# EAGLE design NANO33BLE_V4.0 (EAGLE 9.6.2)
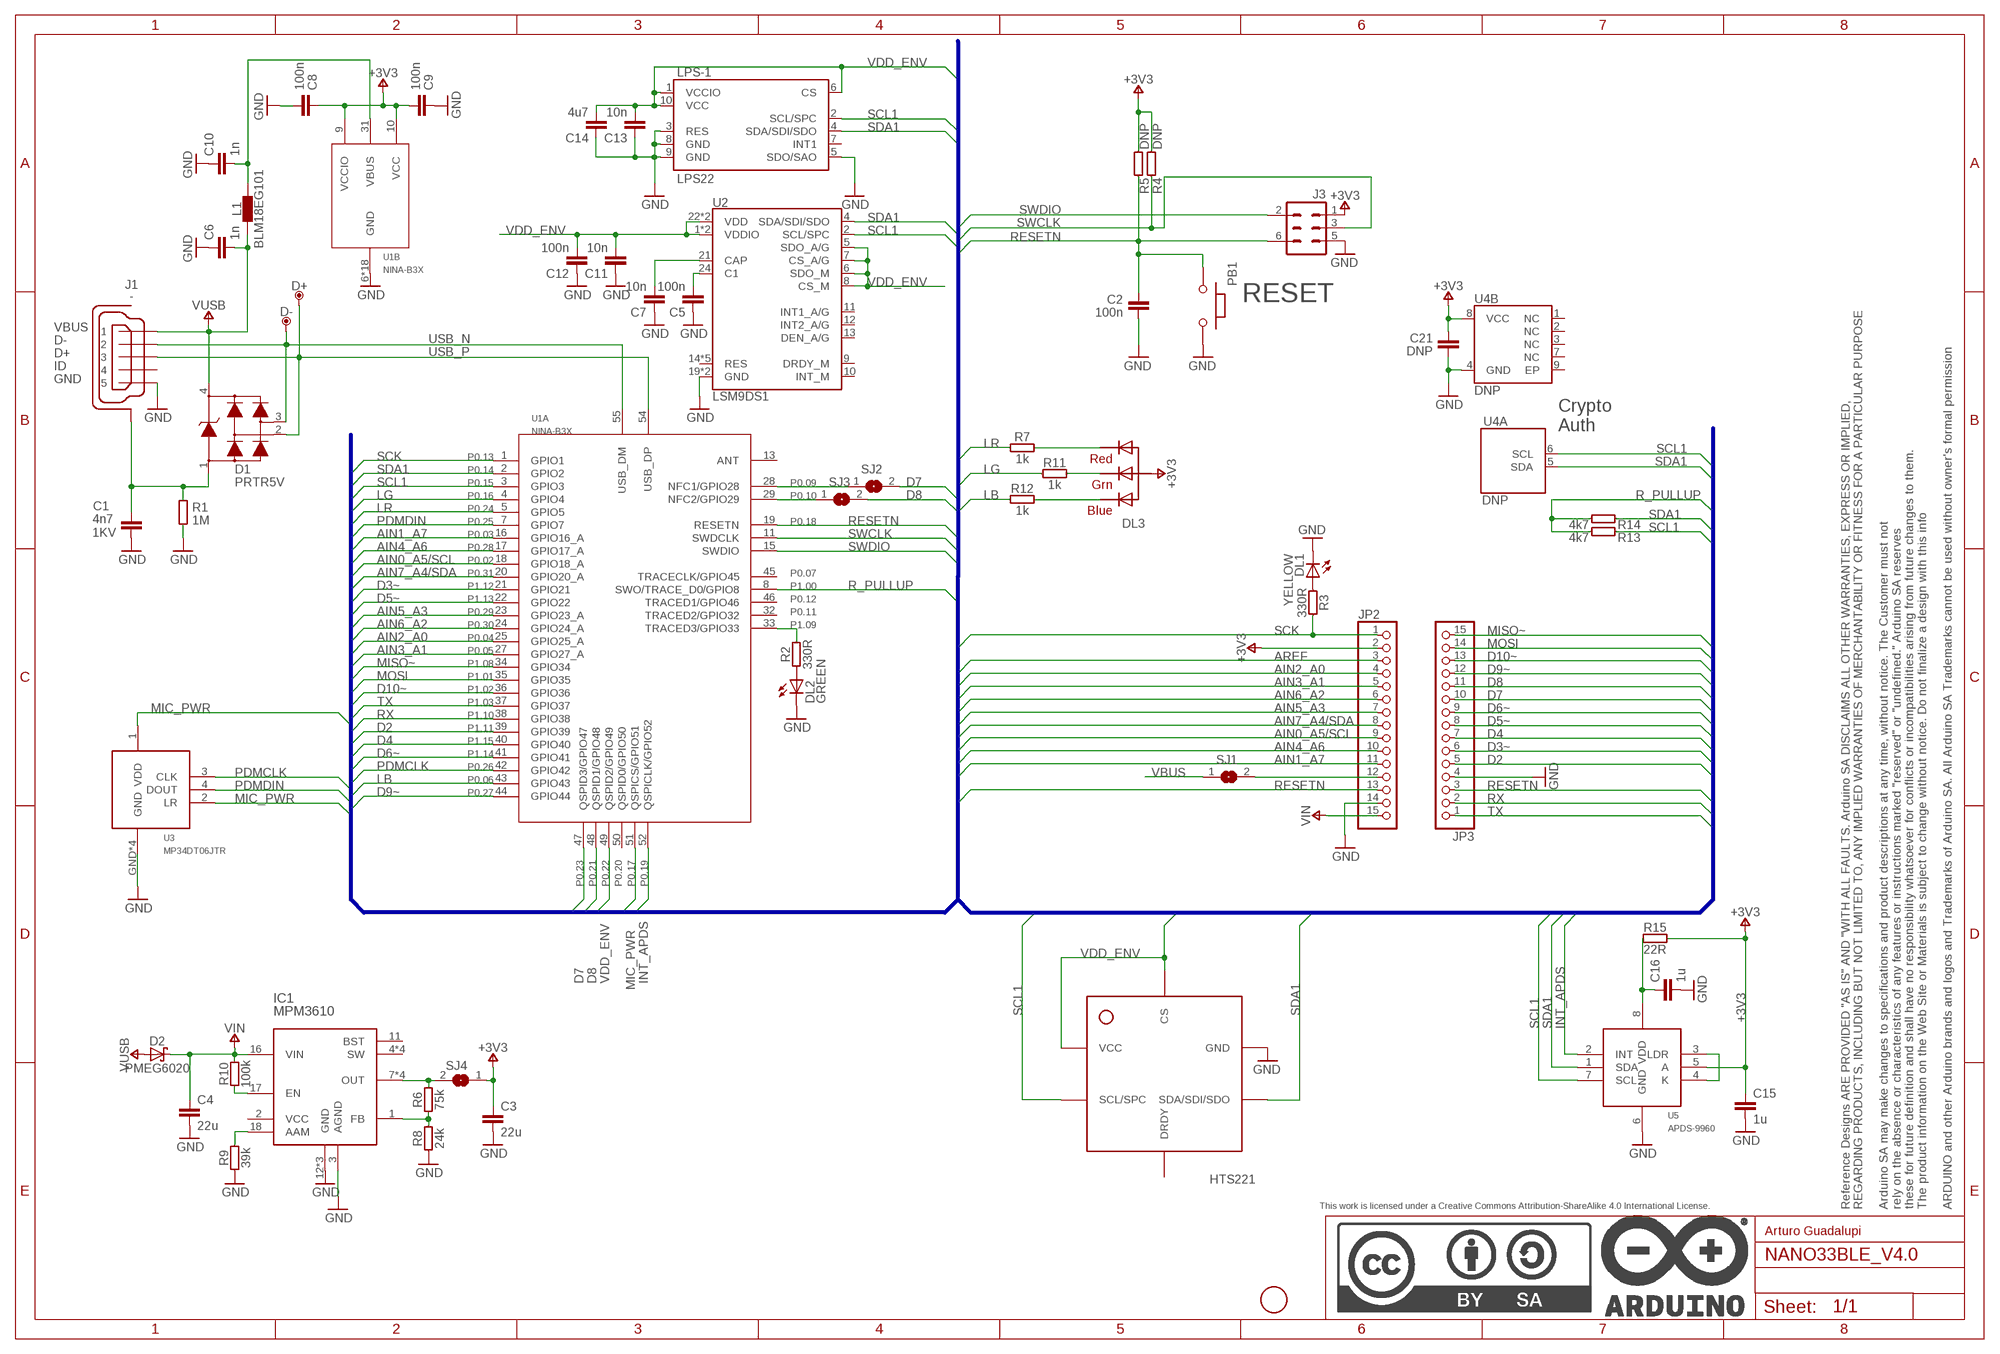
[diagram p0: schematic, sheet 1]

## Parts
C1  4n7  C4.7NF-0805  [0805-R2013X50N]
C2  100n  C-100NF-0402  [0402-1005X55N]
C3  22u  C-22U-0805  [0805-R2013X50N]
C4  22u  C-22U-0805  [0805-R2013X50N]
C5  100n  C-100NF-0402  [0402-1005X55N]
C6  1n  C-1NF-0402  [0402-1005X55N]
C7  10n  C-10NF-0402  [0402-1005X55N]
C8  100n  C-100NF-0402  [0402-1005X55N]
C9  100n  C-100NF-0402  [0402-1005X55N]
C10  1n  C-1NF-0402  [0402-1005X55N]
C11  10n  C-10NF-0402  [0402-1005X55N]
C12  100n  C-100NF-0402  [0402-1005X55N]
C13  10n  C-10NF-0402  [0402-1005X55N]
C14  4u7  C-4.7UF-0402  [0402-1005X55N]
C15  1u  C-1UF-0402  [0402-1005X55N]
C16  1u  C-1UF-0402  [0402-1005X55N]
C21  DNP  CDNP-0402  [0402-1005X55N]
D1  PRTR5V  PRTR5V0U2X,215  [SOT190P230X110-4N]
D2  PMEG6020  PMEG6020AELRX  [SODFL3517X110N]
D+  DNP  TPTP-1.00MM  [TP-1.00MM]
D-  DNP  TPTP-1.00MM  [TP-1.00MM]
DL1  YELLOW  LED-YELLOW-0603  [LEDC1608X80N-AK]
DL2  GREEN  LED-GREEN-0603  [LEDC1608X80N-AK]
DL3  -  RGBLED-KA  [SMLP34RGB2W]
FD1  DNP  FIDUCIAL-1.5MM  [FD-1-1.5]
FRAME1  DNP  A3-FRAME  [FRAME]
HS-1  HTS221  [HTS221]
IC1  MPM3610  [MPM3610]
J1  -  USB-MICRO  [ZX62-AB-5PA]
J3  DNP  PINHD-2X03(NO4)  [2X03-TP1]
JP2  PINHD-1X15-CASTELLATED  [1X15-CASTELL]
JP3  PINHD-1X15-CASTELLATED  [1X15-CASTELL]
L1  BLM18EG101  FERRITE-100R0603  [0603-1608X90N]
LPS-1  LPS22  LPS2XH-22  [LPS22H]
PB1  TACTILE3NO_SH  [C&K_PTS820_NO_SH]
R1  1M  R-1M-0402  [0402-1005X55N]
R2  330R  R-330R-0402  [0402-1005X55N]
R3  330R  R-330R-0402  [0402-1005X55N]
R4  DNP  R-DNP-0402  [0402-1005X55N]
R5  DNP  R-DNP-0402  [0402-1005X55N]
R6  75k  R-75K-0402  [0402-1005X55N]
R7  1k  R-1K-0402  [0402-1005X55N]
R8  24k  R-24K-0402  [0402-1005X55N]
R9  39k  R-39K-0402  [0402-1005X55N]
R10  100k  R-100K-0402  [0402-1005X55N]
R11  1k  R-1K-0402  [0402-1005X55N]
R12  1k  R-1K-0402  [0402-1005X55N]
R13  4k7  R-4K7-0402  [0402-1005X55N]
R14  4k7  R-4K7-0402  [0402-1005X55N]
R15  22R  R-22R-0402  [0402-1005X55N]
SJ1  DNP  SJ  [SJ]
SJ2  DNP  SJ  [SJ]
SJ3  DNP  SJ  [SJ]
SJ4  DNP  SJ  [SJ]
U1  NINA-B3X  [NINA-B3X]
U2  LSM9DS1  LSM9DS1_TEMP_LSM9DS1  [LSM9DS1_TEMP_LGA24-8X4]
U3  MP34DT06JTR  MP34DT06  [HCLGA]
U4  DNP  ATECC-DNP8-UDFN  [SON50P300X200X60-9N-EP160X140]
U5  APDS-9960  APDS9960  [APDS9960]

## Nets
+3V3: C3.1 C8.1 C9.2 C15.1 C21.1 DL3.1(A) J3.1 JP2.2 R4.2 R5.2 R15.2 SJ4.1 U1.9(B:VCCIO) U1.10(B:VCC) U4.8(B:VCC) U5.5(A)
AIN0_A5/SCL: JP2.9 U1.18(A:GPIO18_A)
AIN1_A7: JP2.11 U1.16(A:GPIO16_A)
AIN2_A0: JP2.4 U1.25(A:GPIO25_A)
AIN3_A1: JP2.5 U1.27(A:GPIO27_A)
AIN4_A6: JP2.10 U1.17(A:GPIO17_A)
AIN5_A3: JP2.7 U1.23(A:GPIO23_A)
AIN6_A2: JP2.6 U1.24(A:GPIO24_A)
AIN7_A4/SDA: JP2.8 U1.20(A:GPIO20_A)
AREF: JP2.3
D2: JP3.5 U1.39(A:GPIO39)
D3~: JP3.6 U1.21(A:GPIO21)
D4: JP3.7 U1.40(A:GPIO40)
D5~: JP3.8 U1.22(A:GPIO22)
D6~: JP3.9 U1.41(A:GPIO41)
D7: JP3.10 SJ2.2 U1.47(A:QSPID3/GPIO47)
D8: JP3.11 SJ3.2 U1.48(A:QSPID1/GPIO48)
D9~: JP3.12 U1.44(A:GPIO44)
D10~: JP3.13 U1.36(A:GPIO36)
GND: C1.2 C2.2 C3.2 C4.2 C5.1 C6.1 C7.1 C8.2 C9.1 C10.1 C11.1 C12.1 C13.1 C14.1 C15.2 C16.2 C21.2 DL1.C DL2.C HS-1.P$5.GND(GND) IC1.3(AGND) IC1.12(GND) IC1.13(GND) IC1.14(GND) J1.5 J3.5 JP2.14 JP3.4 LPS-1.3(RES) LPS-1.5(SDO/SAO) LPS-1.8(GND) LPS-1.9(GND) PB1.6 R1.1 R8.1 R9.1 U1.6(B:GND) U1.12(B:GND) U1.14(B:GND) U1.26(B:GND) U1.30(B:GND) U1.53(B:GND) U1.GND@1(B:GND) U1.GND@2(B:GND) U1.GND@3(B:GND) U1.GND@4(B:GND) U1.GND@5(B:GND) U1.GND@6(B:GND) U1.GND@7(B:GND) U1.GND@8(B:GND) U1.GND@9(B:GND) U1.GND@10(B:GND) U1.GND@11(B:GND) U1.GND@12(B:GND) U2.19(GND) U2.20(GND) U3.GND U3.GND@2(GND) U3.GND@3(GND) U3.GND@4(GND) U4.4(B:GND) U5.6(GND)
INT_APDS: U1.52(A:QSPICLK/GPIO52) U5.2(INT)
LB: R12.1 U1.43(A:GPIO43)
LG: R11.1 U1.4(A:GPIO4)
LR: R7.1 U1.5(A:GPIO5)
MIC_PWR: U1.51(A:QSPICS/GPIO51) U3.1(VDD) U3.2(LR)
MISO~: JP3.15 U1.34(A:GPIO34)
MOSI: JP3.14 U1.35(A:GPIO35)
N$1: C1.1 D1.1 J1.6(SH) J1.7(SH) J1.8(SH) J1.9(SH) J1.10(SH) J1.11(SH) R1.2
N$2: DL2.A R2.1
N$3: DL1.A R3.1
N$4: C5.2 U2.24(C1)
N$5: IC1.1(FB) R6.1 R8.2
N$6: IC1.18(AAM) R9.2
N$7: IC1.17(EN) R10.1
N$8: C7.2 U2.21(CAP)
N$9: U5.3(LDR) U5.4(K)
N$10: R2.2 U1.33(A:TRACED3/GPIO33)
N$11: DL3.3(BLUE_C) R12.2
N$12: DL3.2(RED_C) R7.2
N$13: DL3.4(GREEN_C) R11.2
N$14: JP2.12 SJ1.2
N$15: C16.1 R15.1 U5.8(VDD)
N$16: IC1.7(OUT) IC1.8(OUT) IC1.9(OUT) IC1.20(OUT) R6.2 SJ4.2
NFC1: SJ2.1 U1.28(A:NFC1/GPIO28)
NFC2: SJ3.1 U1.29(A:NFC2/GPIO29)
PDMCLK: U1.42(A:GPIO42) U3.3(CLK)
PDMDIN: U1.7(A:GPIO7) U3.4(DOUT)
R_PULLUP: R13.2 R14.2 U1.8(A:SWO/TRACE_D0/GPIO8)
RESETN: C2.1 J3.6 JP2.13 JP3.3 PB1.5 R5.1 U1.19(A:RESETN)
RX: JP3.2 U1.38(A:GPIO38)
SCK: JP2.1 R3.2 U1.1(A:GPIO1)
SCL1: HS-1.P$2.SCL/SPC(SCL/SPC) LPS-1.2(SCL/SPC) R13.1 U1.3(A:GPIO3) U2.2(SCL/SPC) U4.6(A:SCL) U5.7(SCL)
SDA1: HS-1.P$4.SDA/SDI/SDO(SDA/SDI/SDO) LPS-1.4(SDA/SDI/SDO) R14.1 U1.2(A:GPIO2) U2.4(SDA/SDI/SDO) U4.5(A:SDA) U5.1(SDA)
SWCLK: J3.3 R4.1 U1.11(A:SWDCLK)
SWDIO: J3.2 U1.15(A:SWDIO)
TX: JP3.1 U1.37(A:GPIO37)
USB_N [usb]: D1.3 D-.X J1.2 U1.55(A:USB_DM)
USB_P [usb]: D1.2 D+.X J1.3 U1.54(A:USB_DP)
VBUS: C10.2 L1.2 SJ1.1 U1.31(B:VBUS)
VDD_ENV: C11.2 C12.2 C13.2 C14.2 HS-1.P$1.VDD(VCC) HS-1.P$6.CS(CS) LPS-1.1(VCCIO) LPS-1.6(CS) LPS-1.10(VCC) U1.49(A:QSPID2/GPIO49) U2.1(VDDIO) U2.3(VDDIO) U2.5(SDO_A/G) U2.6(SDO_M) U2.7(CS_A/G) U2.8(CS_M) U2.22(VDD) U2.23(VDD)
VIN: C4.1 D2.C IC1.16(VIN) JP2.15 R10.2
VUSB: C6.2 D1.4 D2.A J1.1 L1.1
Unconnected: HS-1.P$3.DRDY(DRDY) IC1.2(VCC) IC1.4(SW) IC1.5(SW) IC1.6(SW) IC1.11(BST) IC1.19(SW) J1.4 LPS-1.7(INT1) U1.13(A:ANT) U1.32(A:TRACED2/GPIO32) U1.45(A:TRACECLK/GPIO45) U1.46(A:TRACED1/GPIO46) U1.50(A:QSPID0/GPIO50) U2.9(DRDY_M) U2.10(INT_M) U2.11(INT1_A/G) U2.12(INT2_A/G) U2.13(DEN_A/G) U2.14(RES) U2.15(RES) U2.16(RES) U2.17(RES) U2.18(RES) U4.1(B:NC) U4.2(B:NC) U4.3(B:NC) U4.7(B:NC) U4.9(B:EP)

## Buses
+3V3,+3V3D,A1,A6,A7,AIN0_A5/SCL,AIN1_A7,AIN2_A0,AIN3_A1,AIN4_A6,AIN5_A3,AIN6_A2,AIN7_A4/SDA,APDS_PWR,AREF,D2,D3~,D4,D5~,D6~,D7,D8,D9~,D10~,GND,INT_APDS,LB,LED_BLUE,LED_GREEN,LED_RED,LG,LR,MIC_PWR,MISO~,MOSI,NFC1,NFC2,PA12_S2_TX/MOSI,PA13_S2_RX/MISO,PA14_S2_RTS/CS,PA15_S2_CTS/SCK,PA22_TC4-W0,PA23_TC4-W1,PA27_GPIO0,PA28_ACK,PB08_RST,PB11_TCC0-W5,PDMCLK,PDMDIN,RESET#,RESETN,R_PULLUP,RSTN_NINA,RX,RX_NINA,SCK,SCL1,SDA1,SWCLK,SWDIO,TX,TX_NINA,USB_N,USB_P,VBUS,VDD_ENV,VIN,VUSB
+3V3,+3V3D,A1,A6,A7,AIN1_A7,AIN2_A0,AIN3_A1,AIN4_A6,AIN5_A3,AIN6_A2,APDS_PWR,AREF,D2,D3~,D4,D5~,D6~,D7,D8,D9~,D10~,GND,LB,LED_BLUE,LED_GREEN,LED_RED,LG,LR,MISO~,MOSI,N$1,N$2,N$3,N$4,N$5,N$6,N$7,N$8,N$10,N$11,N$12,N$13,NFC1,NFC2,PA12_S2_TX/MOSI,PA13_S2_RX/MISO,PA14_S2_RTS/CS,PA15_S2_CTS/SCK,PA27_GPIO0,PA28_ACK,PB08_RST,RESETN,R_PULLUP,RSTN_NINA,RX,RX_NINA,SCK,SCL1,SDA1,SWCLK,SWDIO,TX,TX_NINA,USB_N,USB_P,VBUS,VDD_ENV,VIN,VUSB

## Notes on the sheet
- RESET
- Crypto
  Auth
- HTS221
- Arturo Guadalupi

## Library data of the parts
C1 = Arduino-rcl:C: SMD Capacitor; CODE-ARDUINO: 0689; DATASHEET: http://www.kemet.com/Lists/ProductCatalog/Attachments/40/KEM_C1010_X7R_HV_SMD.pdf; DISTRIBUTOR-LINK: www.kemet.com/docfinder?Partnumber=C0805C472KDRACTU; DISTRIBUTOR-PN: 399-6738-1-ND; MANUFACTURER: Kemet; MANUFACTURER-PN: C0805C472KDRACTU; NOTE: -; VOLTAGE: 1KV
C2 C5 C8 C9 C12 = Arduino-rcl:C: SMD Capacitor; CODE-ARDUINO: 0132; DATASHEET: http://www.tdk.com/pdf/TDKMLCCCapRange.pdf; DISTRIBUTOR-LINK: http://www.digikey.com/product-detail/en/tdk-corporation/C1005X5R1H104K050BB/445-5942-1-ND/2443982; DISTRIBUTOR-PN: 445-5942-1-ND; MANUFACTURER: TDK; MANUFACTURER-PN: C1005X5R1H104K050BB; NOTE: -
C3 C4 = Arduino-rcl:C: SMD Capacitor; CODE-ARDUINO: 2233; DATASHEET: https://media.digikey.com/pdf/Data%20Sheets/Samsung%20PDFs/CL21A226MQCLQNC_character.pdf; DISTRIBUTOR-LINK: https://www.digikey.com/product-detail/en/samsung-electro-mechanics-america-inc/CL21A226MQCLQNC/1276-2412-1-ND/3890498; DISTRIBUTOR-PN: 1276-2412-1-ND; MANUFACTURER: Samsung; MANUFACTURER-PN: CL21A226MQCLQNC; NOTE: -
C6 C10 = Arduino-rcl:C: SMD Capacitor; CODE-ARDUINO: 2321; DATASHEET: http://www.samsungsem.com/kr/support/product-search/mlcc/__icsFiles/afieldfile/2016/08/18/S_CL05B102KB5NNNC.pdf; DISTRIBUTOR-LINK: http://www.digikey.com/product-detail/en/samsung-electro-mechanics-america-inc/CL05B102KB5NNNC/1276-1032-1-ND/3889118; DISTRIBUTOR-PN: 1276-1032-1-ND; MANUFACTURER: Samsung; MANUFACTURER-PN: CL05B102KB5NNNC; NOTE: -
C7 C11 C13 = Arduino-rcl:C: SMD Capacitor; CODE-ARDUINO: 0165; DATASHEET: http://search.murata.co.jp/Ceramy/image/img/A01X/partnumbering_e_01.pdf; DISTRIBUTOR-LINK: http://www.digikey.com/product-detail/en/murata-electronics-north-america/GRM155R71H103KA88J/490-6351-1-ND/3845548; DISTRIBUTOR-PN: 490-6351-1-ND; MANUFACTURER: Murata; MANUFACTURER-PN: GRM155R71H103KA88J; NOTE: -
C14 = Arduino-rcl:C: SMD Capacitor; CODE-ARDUINO: 0833; DATASHEET: http://search.murata.co.jp/Ceramy/image/img/A01X/partnumbering_e_01.pdf; DISTRIBUTOR-LINK: http://www.digikey.com/product-detail/en/murata-electronics-north-america/GRM155R60J475ME47D/490-5915-1-ND/3719860; DISTRIBUTOR-PN: 490-5915-1-ND; MANUFACTURER: Murata; MANUFACTURER-PN: GRM155R60J475ME47D; NOTE: -
C15 C16 = Arduino-rcl:C: SMD Capacitor; CODE-ARDUINO: 0133; DATASHEET: http://search.murata.co.jp/Ceramy/image/img/A01X/partnumbering_e_01.pdf; DISTRIBUTOR-LINK: http://www.digikey.com/product-detail/en/murata-electronics-north-america/GRM155R61E105KA12D/490-10017-1-ND/5026367; DISTRIBUTOR-PN: 490-10017-1-ND; MANUFACTURER: Murata; MANUFACTURER-PN: GRM155R61E105KA12D; NOTE: -
C21 = Arduino-rcl:C: SMD Capacitor; CODE-ARDUINO: DNP; DATASHEET: DNP; DISTRIBUTOR-LINK: DNP; DISTRIBUTOR-PN: DNP; MANUFACTURER: DNP; MANUFACTURER-PN: DNP; NOTE: DNP
D1 = Arduino-diodes:PRTR5V0U2X,215: USB ESD protection; CODE-ARDUINO: 2209; DATASHEET: http://www.nxp.com/documents/data_sheet/PRTR5V0U2X.pdf; DISTRIBUTOR-LINK: http://www.digikey.com/product-detail/en/nxp-semiconductors/PRTR5V0U2X,215/568-4140-1-ND/1589981; DISTRIBUTOR-PN: 568-4140-1-ND; MANUFACTURER: NXP; MANUFACTURER-PN: PRTR5V0U2X,215
D2 = Arduino-diodes:PMEG6020AELRX: 60 V, 2 A low leakage current Schottky barrier rectifier Datasheet <http://www.nxp.com/documents/data_sheet/PMEG6020AELR.pdf>; CODE-ARDUINO: 2208; DATASHEET: http://www.nxp.com/documents/data_sheet/PMEG6020AELR.pdf; DISTRIBUTOR-LINK: http://www.digikey.com/products/en?keywords=%20568-12710-1-ND; DISTRIBUTOR-PN: 568-12710-1-ND; MANUFACTURER: NXP; MANUFACTURER-PN: PMEG6020AELRX
D+ D- = Arduino-utility:TP: Testpoint; CODE-ARDUINO: DNP; DATASHEET: DNP; DISTRIBUTOR-LINK: DNP; DISTRIBUTOR-PN: DNP; MANUFACTURER: DNP; MANUFACTURER-PN: DNP
DL1 = Arduino-diodes:LED: LED; CODE-ARDUINO: 2243; DATASHEET: http://media.digikey.com/pdf/Data%20Sheets/Avago%20PDFs/HSMz-Czzz.pdf; DISTRIBUTOR-LINK: http://www.digikey.com/product-detail/en/broadcom-limited/HSMY-C190/516-1424-1-ND/637748; DISTRIBUTOR-PN: 516-1424-1-ND; MANUFACTURER: Avago; MANUFACTURER-PN: HSMY-C190
DL2 = Arduino-diodes:LED: LED; CODE-ARDUINO: 2204; DATASHEET: http://media.digikey.com/pdf/Data%20Sheets/Avago%20PDFs/HSMz-Czzz.pdf; DISTRIBUTOR-LINK: http://www.digikey.com/product-detail/en/broadcom-limited/HSMG-C190/516-1425-1-ND/637749; DISTRIBUTOR-PN: 516-1425-1-ND; MANUFACTURER: Avago; MANUFACTURER-PN: HSMG-C190
DL3 = Arduino-diodes:RGBLED-KA: 5050 RGB LED; DATASHEET: https://www.rohm.com/datasheet/SMLP34RGB2W; DISTRIBUTOR-LINK: https://www.digikey.com/product-detail/en/rohm-semiconductor/SMLP34RGB2W3/SMLP34RGB2W3CT-ND/2921110; DISTRIBUTOR-PN: SMLP34RGB2W3CT-ND; MANUFACTURER-PN: SMLP34RGB2W3
FD1 = Arduino-utility:FIDUCIAL: Fiducial mount; CODE-ARDUINO: DNP; DATASHEET: DNP; DISTRIBUTOR-LINK: DNP; DISTRIBUTOR-PN: DNP; MANUFACTURER: DNP; MANUFACTURER-PN: DNP
FRAME1 = Arduino-utility:A3-FRAME; CODE-ARDUINO: DNP; DATASHEET: DNP; DISTRIBUTOR-LINK: DNP; DISTRIBUTOR-PN: DNP; MANUFACTURER: DNP; MANUFACTURER-PN: DNP; NOTE: DNP
HS-1 = Arduino-Sensors:HTS221; CODE-ARDUINO: A5356; DATASHEET: https://nl.mouser.com/datasheet/2/389/hts221-954783.pdf; DISTRIBUTOR-LINK: https://nl.mouser.com/ProductDetail/STMicroelectronics/HTS221TR?qs=%2fha2pyFaduhYqhgVSCoMJjbIcKdCD1D5p03chi4OA3k%3d; DISTRIBUTOR-PN: 511-HTS221TR; MANUFACTURER: STMicroelectronics; MANUFACTURER-PN: HTS221TR
IC1 = Arduino-ICs:MPM3610: MPM3610 Step Down Regulator; CODE-ARDUINO: 2093; DATASHEET: https://www.monolithicpower.com/pub/media/document/MPM3610_r1.01.pdf; DISTRIBUTOR-LINK: https://www.digikey.com/product-detail/en/monolithic-power-systems-inc/MPM3610AGQV-P/1589-1249-1-ND/5298336; DISTRIBUTOR-PN: 1589-1249-1-ND; MANUFACTURER: MPS; MANUFACTURER-PN: MPM3610AGQV-P; RESTRICTIONS: NO
J1 = Arduino-connectors:USB-MICRO: USB - micro AB USB 2.0 Receptacle Connector 5 Position Surface Mount, Right Angle, Horizontal; CODE-ARDUINO: 2219; DATASHEET: https://www.hirose.com/product/en/download_file/key_name/ZX/category/Catalog/doc_file_id/31704/?file_category_id=4&item_id=13&is_series=1; DISTRIBUTOR-LINK: http://www.digikey.com/product-detail/en/hirose-electric-co-ltd/ZX62-AB-5PA(31)/H125279CT-ND/5994741; DISTRIBUTOR-PN: H125279CT-ND; MANUFACTURER: Hirose; MANUFACTURER-PN: ZX62-AB-5PA(31)
J3 = Arduino-connectors:PINHD-2X03(NO4): PIN HEADER; CODE-ARDUINO: DNP; DATASHEET: DNP; DISTRIBUTOR-LINK: DNP; DISTRIBUTOR-PN: DNP; MANUFACTURER: DNP; MANUFACTURER-PN: DNP
JP2 JP3 = Arduino-connectors:PINHD-1X15: PIN HEADER
L1 = Arduino-rcl:FERRITE: SMD ferrite; CODE-ARDUINO: -; DATASHEET: http://www.murata.com/en-us/products/productdata/8796747366430/ENFA0021.pdf; DISTRIBUTOR-LINK: https://www.digikey.com/product-detail/en/murata-electronics-north-america/BLM18EG101TN1D/490-5978-1-ND/3845178; DISTRIBUTOR-PN: 490-5978-1-ND; MANUFACTURER: Murata; MANUFACTURER-PN: BLM18EG101TN1D; NOTE: -
LPS-1 = Arduino-Sensors:LPS2XH; CODE-ARDUINO: A5390; DATASHEET: https://www.st.com/content/ccc/resource/technical/document/datasheet/bf/c1/4f/23/61/17/44/8a/DM00140895.pdf/files/DM00140895.pdf/jcr:content/translations/en.DM00140895.pdf; DISTRIBUTOR-LINK: https://www.digikey.com/product-detail/en/stmicroelectronics/LPS22HBTR/497-16265-1-ND/5799917; DISTRIBUTOR-PN: 497-16265-1-ND; MANUFACTURER: ST; MANUFACTURER-PN: LPS22HBTR
PB1 = Arduino-pushbuttons:TACTILE3
R1 = Arduino-rcl:R: SMD Resistor; CODE-ARDUINO: 0139; DATASHEET: www.yageo.com.tw/exep/pages/download/literatures/PYu-R_INT-thick_7.pdf; DISTRIBUTOR-LINK: http://www.digikey.com/product-detail/en/yageo/RC0402JR-07330RL/311-330JRCT-ND/729412; DISTRIBUTOR-PN: 311-330JRCT-ND; MANUFACTURER: Yageo; MANUFACTURER-PN: RC0402JR-07330RL; NOTE: NO
R2 R3 = Arduino-rcl:R: SMD Resistor; CODE-ARDUINO: 2229; DATASHEET: www.yageo.com.tw/exep/pages/download/literatures/PYu-R_INT-thick_7.pdf; DISTRIBUTOR-LINK: http://www.digikey.com/product-detail/en/yageo/RC0402FR-07330RL/311-330LRCT-ND/729541; DISTRIBUTOR-PN: 311-330LRCT-ND; MANUFACTURER: Yageo; MANUFACTURER-PN: RC0402FR-07330RL; NOTE: NO
R4 R5 = Arduino-rcl:R: SMD Resistor; CODE-ARDUINO: DNP; DATASHEET: DNP; DISTRIBUTOR-LINK: DNP; DISTRIBUTOR-PN: DNP; MANUFACTURER: DNP; MANUFACTURER-PN: DNP; NOTE: NO
R6 = Arduino-rcl:R: SMD Resistor; CODE-ARDUINO: A5480; DATASHEET: www.yageo.com.tw/exep/pages/download/literatures/PYu-R_INT-thick_7.pdf; DISTRIBUTOR-LINK: https://www.digikey.com/products/en?keywords=%20AC0402JR-0775KL; DISTRIBUTOR-PN: AC0402JR-0775KL-ND; MANUFACTURER: Yageo; MANUFACTURER-PN: AC0402JR-0775KL; NOTE: NO
R7 R11 R12 = Arduino-rcl:R: SMD Resistor; CODE-ARDUINO: 0140; DATASHEET: www.yageo.com.tw/exep/pages/download/literatures/PYu-R_INT-thick_7.pdf; DISTRIBUTOR-LINK: http://www.digikey.com/product-detail/en/yageo/RC0402FR-071KL/311-1.00KLRCT-ND/729460; DISTRIBUTOR-PN: 311-1.00KLRCT-ND; MANUFACTURER: Yageo; MANUFACTURER-PN: RC0402FR-071KL; NOTE: NO
R8 = Arduino-rcl:R: SMD Resistor; CODE-ARDUINO: A5478; DATASHEET: http://www.yageo.com/NewPortal/yageodocoutput?fileName=/pdf/R-Chip/PYu-AC_51_RoHS_L_6.pdf; DISTRIBUTOR-LINK: https://www.digikey.com/products/en?keywords=AC0402JR-0724KL; DISTRIBUTOR-PN: AC0402JR-0724KL-ND; MANUFACTURER: Yageo; MANUFACTURER-PN: AC0402JR-0724KL; NOTE: NO
R9 = Arduino-rcl:R: SMD Resistor; CODE-ARDUINO: A5479; DATASHEET: www.yageo.com.tw/exep/pages/download/literatures/PYu-R_INT-thick_7.pdf; DISTRIBUTOR-LINK: https://www.digikey.com/product-detail/en/yageo/RC0402JR-0739KL/311-39KJRCT-ND/729420; DISTRIBUTOR-PN: 311-39KJRCT-ND; MANUFACTURER: Yageo; MANUFACTURER-PN: RC0402JR-0739KL; NOTE: NO
R10 = Arduino-rcl:R: SMD Resistor; CODE-ARDUINO: 0134; DATASHEET: www.yageo.com.tw/exep/pages/download/literatures/PYu-R_INT-thick_7.pdf; DISTRIBUTOR-LINK: http://www.digikey.com/product-detail/en/yageo/RC0402FR-07100KL/311-100KLRCT-ND/729473; DISTRIBUTOR-PN: 311-100KLRCT-ND; MANUFACTURER: Yageo; MANUFACTURER-PN: RC0402FR-07100KL; NOTE: NO
R13 R14 = Arduino-rcl:R: SMD Resistor; CODE-ARDUINO: 2196; DATASHEET: www.yageo.com.tw/exep/pages/download/literatures/PYu-R_INT-thick_7.pdf; DISTRIBUTOR-LINK: http://www.digikey.com/product-detail/en/yageo/RC0402FR-074K7L/311-4.7KLRCT-ND/2827881; DISTRIBUTOR-PN: 311-4.7KLRCT-ND; MANUFACTURER: Yageo; MANUFACTURER-PN: RC0402FR-074K7L; NOTE: NO
R15 = Arduino-rcl:R: SMD Resistor; CODE-ARDUINO: 0468; DATASHEET: www.yageo.com.tw/exep/pages/download/literatures/PYu-R_INT-thick_7.pdf; DISTRIBUTOR-LINK: http://www.digikey.com/products/en?keywords=311-22.0LRCT-ND; DISTRIBUTOR-PN: 311-22.0LRCT-ND; MANUFACTURER: Yageo; MANUFACTURER-PN: RC0402FR-0722RL; NOTE: NO
SJ1-SJ4 = Arduino-utility:SJ: SMD solder JUMPER; CODE-ARDUINO: DNP; DATASHEET: DNP; DISTRIBUTOR-LINK: DNP; DISTRIBUTOR-PN: DNP; MANUFACTURER: DNP; MANUFACTURER-PN: DNP
U1 = Arduino-ucs&SoCs:NINA-B3X: UBLOX BLE module
U2 = Arduino-ICs:LSM9DS1_TEMP_LSM9DS1: LSM9DS1 3D accelerometer, gyroscope & magnetometer The LSM9DS1 is a system-in-package featuring a 3D digital linear acceleration sensor, a 3D digital angular rate sensor, and a 3D digital magnetic sensor. The LSM9DS1 has a linear acceleration full scale of ±2g/±4g/±8/±16 g, a magnetic field full scale of ±4/±8/±12/±16 gauss and an angular rate of ±245/±500/±2000 dps. The LSM9DS1 includes an I2 C serial bus interface supporting standard and fast mode (100 kHz and 400 kHz) and an SPI serial standard interface. Magnetic, accelerometer and gyroscope sensing can be enabled or set in power-down mode separately for smart power management. The LSM9DS1 is available in a plastic land grid array package (LGA) and it is guaranteed to operate over an extended temperature range from -40 °C to +85 °C.; CODE-ARDUINO: A5430; DATASHEET: https://www.st.com/content/ccc/resource/technical/document/datasheet/1e/3f/2a/d6/25/eb/48/46/DM00103319.pdf/files/DM00103319.pdf/jcr:content/translations/en.DM00103319.pdf; DISTRIBUTOR-LINK: https://www.digikey.com/product-detail/en/stmicroelectronics/LSM9DS1TR/497-14946-1-ND/4988079; DISTRIBUTOR-PN: 497-14946-1-ND; MANUFACTURER: ST; MANUFACTURER-PN: LSM9DS1TR; NOTE: NO
U3 = Arduino-Sensors:MP34DT06; CODE-ARDUINO: A5470; DATSHEET: https://www.st.com/resource/en/datasheet/mp34dt06j.pdf; DISTRIBUTOR-LINK: https://www.digikey.com/product-detail/en/stmicroelectronics/MP34DT06JTR/497-18180-1-ND/9605997; DISTRIBUTOR-PN: 497-18180-1-ND; MANUFACTURER-PN: MP34DT06JTR
U4 = Arduino-ICs:ATECC: Secure authentication and product validation device, EEPROM, I2C, 2.0 - 5.5V; CODE-ARDUINO: DNP; DATASHEET: DNP; DISTRIBUTOR-LINK: DNP; DISTRIBUTOR-PN: DNP; MANUFACTURER: DNP; MANUFACTURER-PN: DNP; NOTE: DNP
U5 = Arduino-Sensors:APDS9960; CODE-ARDUINO: A5475; DATASHEET: https://docs.broadcom.com/docs/AV02-4191EN; DISTRIBUTOR-LINK: https://www.digikey.com/product-detail/en/broadcom-limited/APDS-9960/516-3480-1-ND/6677150; DISTRIBUTOR-PN: 516-3480-1-ND; MANUFACTURER: Broadcom; MANUFACTURER-PN: APDS-9960; NOTE: NO

## Net classes
0 default: width 0.19 mm, drill 0.19 mm
1 usb: width 0.19 mm, drill 0.19 mm

## Board
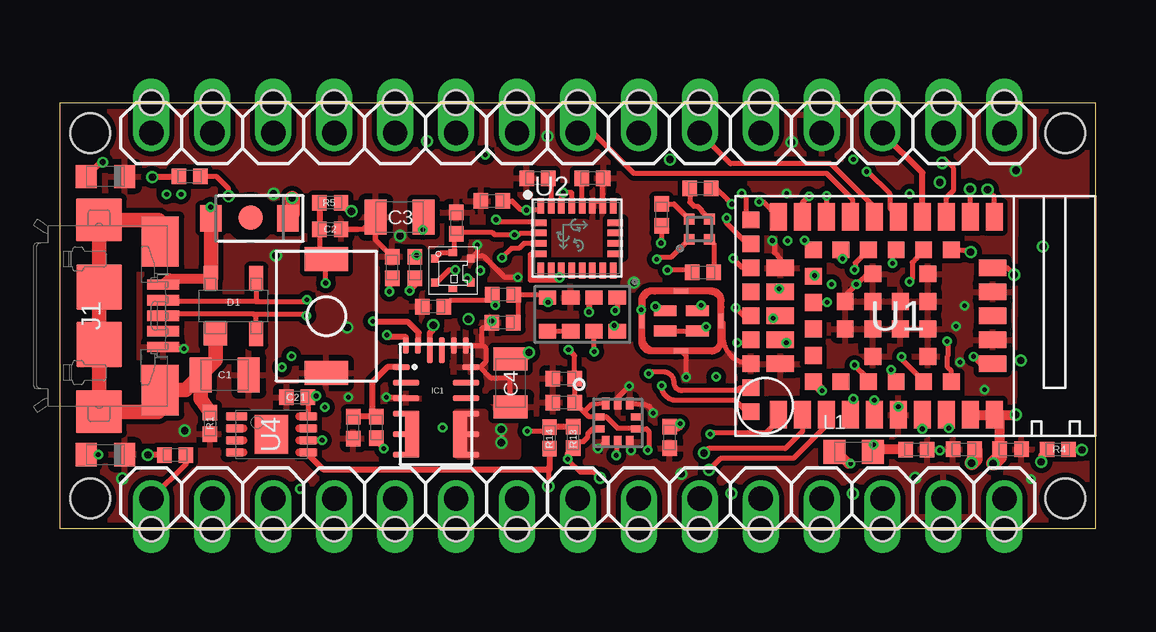
[diagram p1: board, top side]
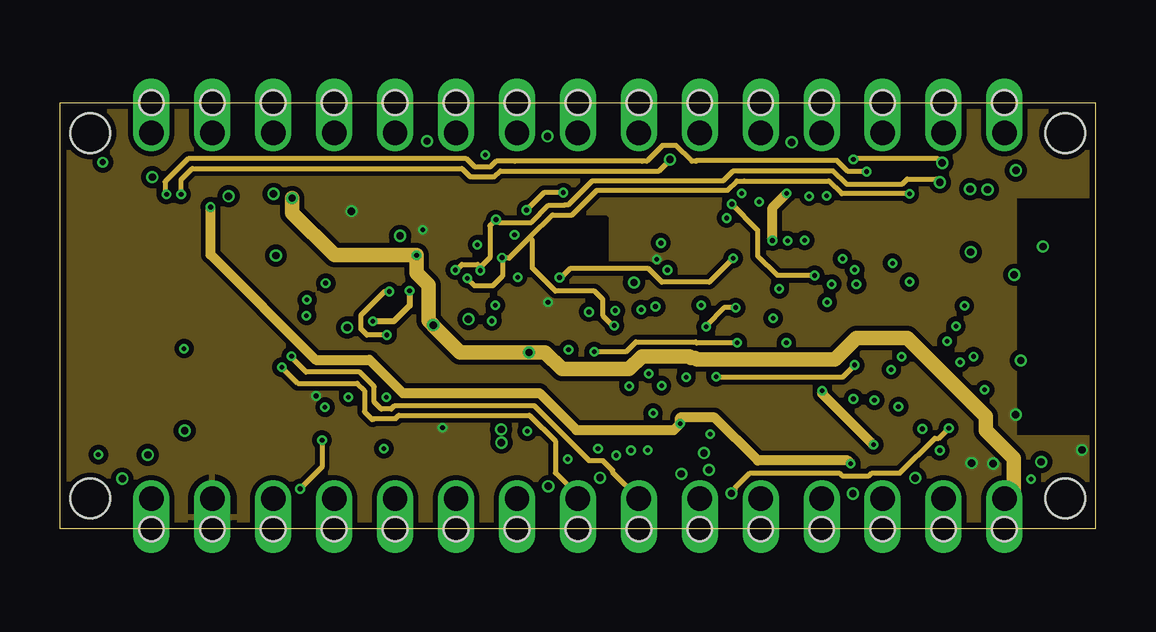
[diagram p2: board, inner layer PWR]
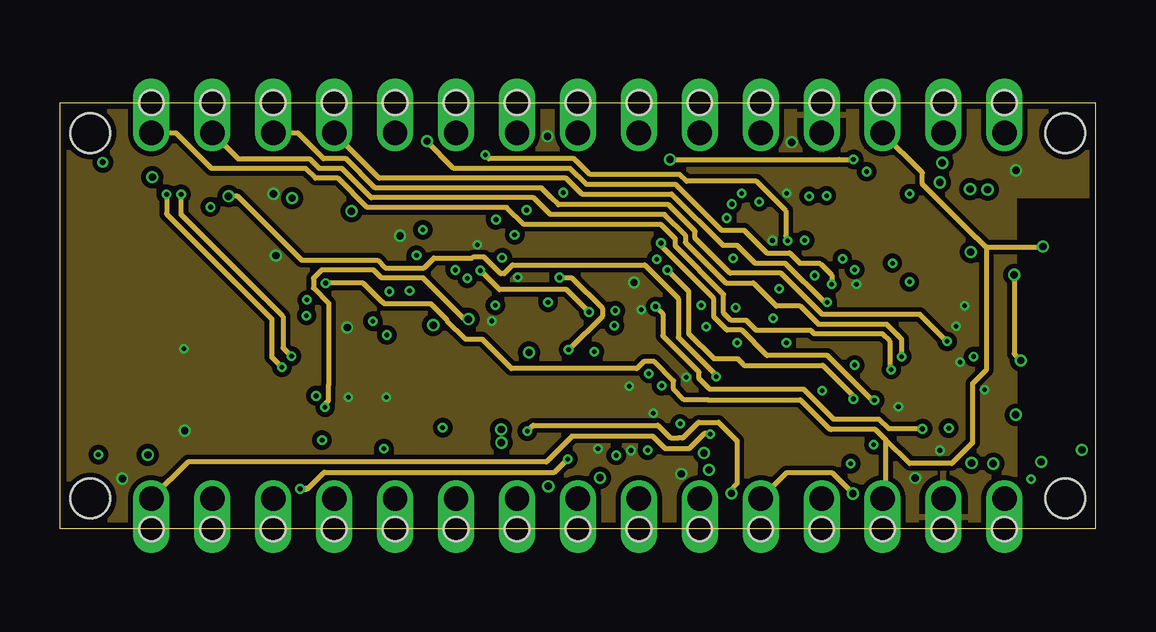
[diagram p3: board, inner layer MID]
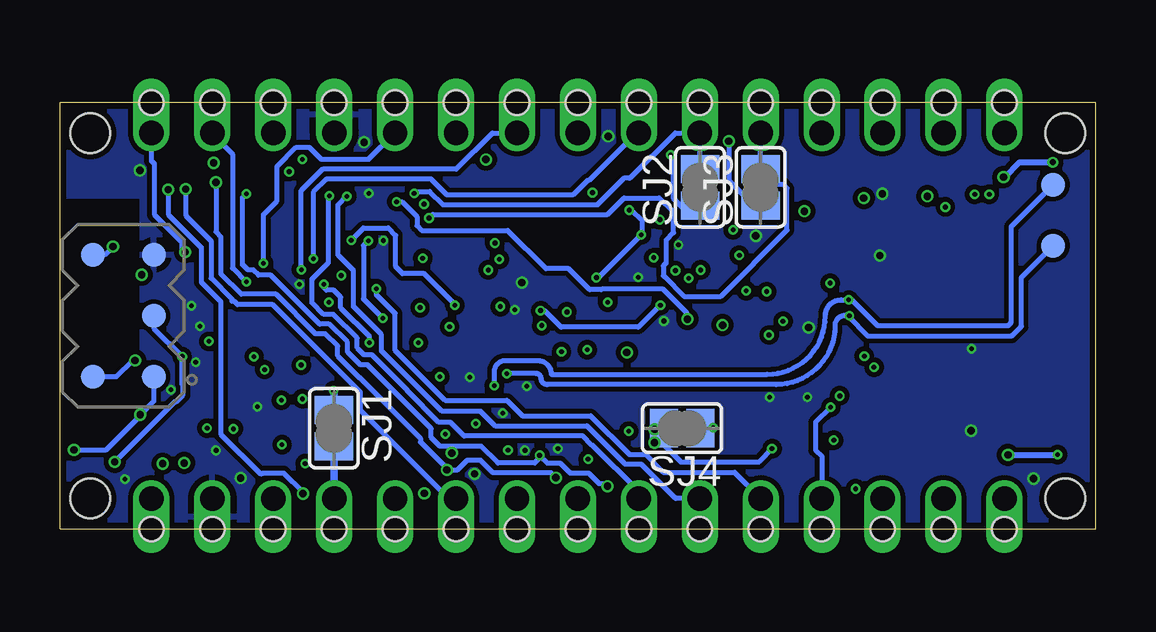
[diagram p4: board, bottom side, seen from below]

Size 43.18 x 17.78 mm. Coordinates in mm from the lower left corner, seen from the top.
Outline: 0,0 0,17.78 43.18,17.78 43.18,0 0,0
Copper layers (1*2*15*16): Top 0.035mm / dielectric 0.2mm / PWR 0.0175mm / dielectric 0.3mm / MID 0.0175mm / dielectric 0.2mm / Bottom 0.035mm
Design rules "SeeedStudio_4layers *": minimum track width 0.003871875mm, minimum drill 0.19mm, track to track 8mil, track to pad 8mil, pad to pad 8mil, via to via 8mil, smd to smd 0mil, copper to edge 10mil, drill to drill 8mil, minimum pad ring 6mil, minimum via ring 4mil, stop-mask expansion 4mil, vias tented up to drill 25mil, thermal gap 10mil
Holes 1.65 mm at 1.27,16.51 1.27,1.27 41.91,1.27 41.91,16.51
tRestrict: 1 lines

### Footprints (pad centres in the part's own frame; a part is rotated, then mirrored left to right if it is on the bottom)
0805-R2013X50N = smd 0.95 x 1.45: 1 -1,0; 2 1,0
0402-1005X55N = smd 0.62 x 0.62: 1 -0.45,0; 2 0.45,0
SOT190P230X110-4N = smd 1 x 1: 1 -1.15,0.75 | smd 1 x 0.6: 2 -1.15,-0.95; 3 1.15,-0.95; 4 1.15,0.95
SODFL3517X110N = smd 0.91 x 1.07: A 1.605,0; C -1.605,0
TP-1.00MM = smd 1 x 1 bottom: X 0,0
LEDC1608X80N-AK = smd 0.9 x 0.95: A 0.8,0; C -0.8,0
SMLP34RGB2W = smd 0.45 x 0.45: 1 0.425,0.425; 2 0.425,-0.425; 3 -0.425,-0.425; 4 -0.425,0.425
FD-1-1.5 = smd 1.016 x 1.016: P$1 0,0
HTS221 = smd 0.3 x 0.35: P$1.VDD -0.75,0.5; P$2.SCL/SPC -0.75,-0.5; P$4.SDA/SDI/SDO 0.75,-0.5; P$5.GND 0.75,0.5 | smd 0.35 x 0.3: P$3.DRDY 0,-0.75; P$6.CS 0,0.75
MPM3610 = smd 0.7 x 0.25: 1 -1.45,1.55; 4 -1.45,-0.4; 5 -1.45,-1.25; 6 -1.45,-2.1; 7 1.45,-2.1; 8 1.45,-1.25; 9 1.45,-0.4; 12 1.45,1.55 | smd 1.1 x 0.25: 2 -1.25,0.9; 3 -1.25,0.25; 10 1.25,0.25; 11 1.25,0.9 | smd 0.25 x 0.7: 13 1.25,2.45; 14 0.75,2.45; 17 -0.75,2.45; 18 -1.25,2.45 | smd 0.25 x 1.1: 15 0.25,2.25; 16 -0.25,2.25 | smd 0.6 x 1.95: 19 -1,-1.25; 20 1,-1.25
ZX62-AB-5PA = smd 0.4 x 1.35: 1 -1.3,3.025; 2 -0.65,3.025; 3 0,3.025; 4 0.65,3.025; 5 1.3,3.025 | smd 2.1 x 1.6: 6 3.1,2.9; 11 -3.1,2.9 | smd 1.8 x 1.9: 7 4,0.35; 10 -4,0.35 | smd 1.9 x 1.9: 8 1.2,0.35; 9 -1.2,0.35
2X03-TP1 = smd 1 x 1 bottom: 1 -2.54,1.27; 2 -2.54,-1.27; 3 0,1.27; 5 2.54,1.27; 6 2.54,-1.27
1X15-CASTELL = drill 1.016 offset: 1 -17.78,0; 2 -15.24,0; 3 -12.7,0; 4 -10.16,0; 5 -7.62,0; 6 -5.08,0; 7 -2.54,0; 8 0,0; 9 2.54,0; 10 5.08,0; 11 7.62,0; 12 10.16,0; 13 12.7,0; 14 15.24,0; 15 17.78,0 | hole 1.016: 17.78,-1.27; 15.24,-1.27; 12.7,-1.27; 10.16,-1.27; 7.62,-1.27; 5.08,-1.27; 2.54,-1.27; 0,-1.27; -2.54,-1.27; -5.08,-1.27; -7.62,-1.27; -10.16,-1.27; -12.7,-1.27; -15.24,-1.27; -17.78,-1.27
0603-1608X90N = smd 0.95 x 1: 1 -0.8,0; 2 0.8,0
LPS22H = smd 0.3 x 0.5: 1 -0.25,-0.8; 2 0.25,-0.8; 6 0.25,0.8; 7 -0.25,0.8 | smd 0.5 x 0.3: 3 0.8,-0.5; 4 0.8,0; 5 0.8,0.5; 8 -0.8,0.5; 9 -0.8,0; 10 -0.8,-0.5
C&K_PTS820_NO_SH = smd 1 x 1.8: 5 -2.375,0; 6 2.375,0
SJ = smd 1.168 x 1.6: 1 -0.762,0; 2 0.762,0
NINA-B3X = smd 0.7 x 1.15: 1 4.95,4.125; 2 3.95,4.125; 3 2.95,4.125; 4 1.95,4.125; 5 0.95,4.125; 6 -0.05,4.125; 7 -1.05,4.125; 8 -2.05,4.125; 9 -3.05,4.125; 10 -4.05,4.125; 16 -4.05,-4.125; 17 -3.05,-4.125; 18 -2.05,-4.125; 19 -1.05,-4.125; 20 -0.05,-4.125; 21 0.95,-4.125; 22 1.95,-4.125; 23 2.95,-4.125; 24 3.95,-4.125; 25 4.95,-4.125 | smd 1.15 x 0.7: 11 -3.975,2; 12 -3.975,1; 13 -3.975,0; 14 -3.975,-1; 15 -3.975,-2; 26 4.875,-2; 27 4.875,-1; 28 4.875,0; 29 4.875,1; 30 4.875,2 | smd 0.7 x 0.7: 31 3.5,2.75; 32 2.35,2.75; 33 1.2,2.75; 34 0.05,2.75; 35 -1.1,2.75; 36 -2.25,2.75; 37 -2.25,-2.75; 38 -1.1,-2.75; 39 0.05,-2.75; 40 1.2,-2.75; 41 2.35,-2.75; 42 3.5,-2.75; 43 3.5,-1.65; 44 3.5,-0.55; 45 3.5,0.55; 46 3.5,1.65; 47 6.1,-4; 48 6.1,-3; 49 6.1,-2; 50 6.1,-1; 51 6.1,0; 52 6.1,1; 53 6.1,2; 54 6.1,3; 55 6.1,4; GND@1 -1.28,1.7; GND@2 -1.28,0.55; GND@3 -1.28,-0.6; GND@4 -1.28,-1.75; GND@5 -0.13,0.55; GND@6 -0.13,-0.6; GND@7 1.02,1.7; GND@8 1.02,0.55; GND@9 1.02,-0.6; GND@10 1.02,-1.75; GND@11 2.17,0.55; GND@12 2.17,-0.6
LSM9DS1_TEMP_LGA24-8X4 = smd 0.27 x 0.65: 1 -1.505,1.35; 6 -1.505,-1.35; 7 -1.075,-1.35; 8 -0.645,-1.35; 9 -0.215,-1.35; 10 0.215,-1.35; 11 0.645,-1.35; 12 1.075,-1.35; 13 1.505,-1.35; 18 1.505,1.35; 19 1.075,1.35; 20 0.645,1.35; 21 0.215,1.35; 22 -0.215,1.35; 23 -0.645,1.35; 24 -1.075,1.35 | smd 0.65 x 0.27: 2 -1.6,0.645; 3 -1.6,0.215; 4 -1.6,-0.215; 5 -1.6,-0.645; 14 1.6,-0.645; 15 1.6,-0.215; 16 1.6,0.215; 17 1.6,0.645
HCLGA = smd 0.95 x 0.45: 1 0.675,0.425; 2 -0.675,0.425; 3 -0.675,-0.425; 4 0.675,-0.425 | smd 0.6 x 0.2: GND 0,1.25; GND@2 0,-1.25 | smd 0.2 x 0.6: GND@3 -1.65,0; GND@4 1.65,0
SON50P300X200X60-9N-EP160X140 = smd 0.3 x 0.85: 1 -0.75,-1.45 | smd 0.3 x 0.7: 2 -0.25,-1.525; 3 0.25,-1.525; 4 0.75,-1.525; 5 0.75,1.525; 6 0.25,1.525; 7 -0.25,1.525; 8 -0.75,1.525 | smd 1.6 x 1.4: 9 0,0
APDS9960 = smd 0.72 x 0.6: 1 -1.455,0.7; 2 -0.485,0.7; 3 0.485,0.7; 4 1.455,0.7; 5 1.455,-0.7; 6 0.485,-0.7; 7 -0.485,-0.7; 8 -1.455,-0.7

### Placement (x,y rotation side)
C1  6.87,6.42 0 top
C2  11.27,12.5 0 top
C3  14.16,13 180 top
C4  18.79,6.09 270 top
C5  19.9,14.62 0 top
C6  25.41,3.81 90 top
C7  22.2,14.62 180 top
C8  37.67,3.32 180 top
C9  39.62,3.32 180 top
C10  35.7,3.31 180 top
C11  18,13.68 0 top
C12  16.52,12.75 270 top
C13  21,5.28 0 top
C14  21,6.28 0 top
C15  18.45,8.6 180 top
C16  15.55,9.28 180 top
C21  9.89,5.49 180 top
D1  7.23,9.3 90 top
D2  7.9,12.95 180 top
D+  1.78,11.81 0 top
D-  1.78,14.35 0 top
DL1  1.9,3.1 180 top
DL2  1.9,14.7 180 top
DL3  26.65,12.5 180 top
FD1  7.94,12.99 0 top
FRAME1  -0.15,-3.35 0 top  (outside the outline)
HS-1  16.38,10.78 0 top
IC1  15.68,5.2 0 top
J1  1.28,8.89 270 top
J3  40.54,8.89 90 top
JP2  21.59,1.27 0 top
JP3  21.59,16.51 180 top
L1  33.09,3.21 0 top
LPS-1  23.25,4.42 270 top
PB1  11.1,8.88 270 top
R1  6.25,4.41 90 top
R2  5.4,14.7 0 top
R3  4.8,3.09 0 top
R4  41.6,3.32 0 top
R5  11.27,13.6 0 top
R6  13.19,4.24 270 top
R7  25.07,13.1 90 top
R8  12.22,4.22 90 top
R9  13.85,10.9 270 top
R10  14.8,10.9 90 top
R11  26.8,10.7 0 top
R12  26.7,14.2 180 top
R13  21.39,3.81 90 top
R14  20.41,3.8 90 top
R15  18.48,9.78 0 top
SJ1  31.76,4.2 270 bottom
SJ2  16.5,14.25 90 bottom
SJ3  13.97,14.25 90 bottom
SJ4  17.25,4.2 180 bottom
U1  34.9,8.89 180 top
U2  21.55,12.12 0 top
U3  25.9,8.68 180 top
U4  8.81,3.94 270 top
U5  21.77,8.95 180 top

### Tracks (layer width: path | path; a pad name or v marks a point on that pad's centre or on a via)
33
  cutout Bottom: 20.3,12.97 22.75,12.97 22.75,11.05 20.3,11.05
  cutout PWR: 20.27,12.97 22.75,12.97 22.75,11.05 20.27,11.05
+3V3  (via drill 0.19, 0.2, 0.3)
  Top 0.203: DL3.1 25.47,11.32 24.98,11.32 24.89,11.23 v24.87,11.25 | U4.8 C21.1 10.4,5.55 v10.68,5.55 | C15.1 19.1,8.8 19.1,9.6 R15.2 20.2,9.78 U5.5 20.34,9.62 v20.34,9.46
  Top 0.254: R4.2 42.58,3.32 v42.6,3.3
  Top 0.305: v12.15,13.25 12.07,13.25 R5.2
  Top 0.406: C3.1 15.12,13.04 v15.12,12.47 | U1.9 U1.10 | U1.10 v39.84,4.76 | C9.2 39.17,4.54 U1.10
  Top 0.61: v38,2.75 38.15,2.9 38.15,3.29 C8.1 | C9.2 39.17,3 v38.9,2.73
  Bottom 0.203: J3.1 39.27,5.33 v39.84,4.76 39.84,4.71 41.25,3.3 v42.6,3.3 | 15.21,12.39 v15.12,12.47 | SJ4.1 16.46,4.22 v15.95,4.22
  pour PWR: 0,18 43.18,18 43.18,13.9 39.75,13.9 39.75,3.8 43.18,3.8 43.18,3.02 43.18,0.03 43.18,0 0,0
AIN0_A5/SCL  (via drill 0.2, 0.3)
  Top 0.203: U1.18 36.95,13.82 37.26,14.12 37.26,15.04 36.85,15.44 36.77,15.37 v36.77,15.27
  PWR 0.2: 12.52,6.52 12.49,6.54 10.26,6.54 9.65,7.15 v9.65,7.2 | v5.05,13.95 5.05,14.57 5.34,14.86
  PWR 0.203: v36.77,15.27 36.6,15.44 33.11,15.44 v33.08,15.41 | JP2.9 23.04,2.36 23.04,2.45 22.64,2.84 22.07,2.84 19.77,5.14 13.95,5.14 13.81,5 13.39,5 13.1,5.29 13.1,5.93 12.52,6.52 | 5.34,14.86 5.52,15.04 16.75,15.04 17.1,14.69 18.1,14.69 18.35,14.93 24.98,14.93 25.43,15.38 v25.43,15.41
  MID 0.2: v9.65,7.2 9.3,7.55 9.3,8.85 5.05,13.1 v5.05,13.95
  MID 0.203: v25.43,15.41 32.48,15.41 v33.08,15.41
AIN1_A7  (via drill 0.3)
  Top 0.203: U1.16 38.95,13.87 v38.67,14.15
  MID 0.203: v33.05,1.48 32.19,2.34 30.28,2.34 JP2.11
  Bottom 0.203: v38.67,14.15 38.67,13.12 37.29,11.74 37.29,10.29 36.47,9.48 36.47,3.95 34.83,2.3 34.77,2.3 34.73,2.34 33.85,2.34 33.05,1.54 v33.05,1.48
AIN2_A0  (via drill 0.19, 0.3)
  Top 0.203: U1.25 29.32,13.65 v29.15,13.65
  MID 0.2: v11.05,5.08 11.05,5.21 11.18,5.34 11.18,6 11.2,6.03
  MID 0.203: v17.02,8.75 16.85,8.75 15.14,10.47 13.4,10.47 13.06,10.8 10.91,10.8 10.57,10.46 10.57,10.04 11.2,9.41 11.2,6.03
  Bottom 0.2: 22.92,10.85 21.98,10.85 21.1,9.98 20.61,9.98 20.59,10 18.04,10 18,9.96
  Bottom 0.203: v29.15,13.65 28.93,13.65 28.3,13.03 28.3,12.65 28.1,12.45 24.52,12.45 22.92,10.85 | JP2.4 11.43,3.04 11.68,3.29 11.68,4.44 v11.05,5.08 | v17.02,8.75 17.02,8.98 18,9.96
AIN3_A1  (via drill 0.19)
  Top 0.203: U1.27 30.02,9.97 v29.98,10.02
  Bottom 0.2: 24.55,5.37 23.9,4.72 21.06,4.72
  Bottom 0.203: 21.06,4.72 19.44,3.11 18.78,3.11 18.04,2.36 15.06,2.36 JP2.5 | 24.55,5.37 27.13,5.37 29.21,7.45 29.21,8.99 29.98,9.77 v29.98,10.02
AIN4_A6  (via drill 0.3)
  Top 0.203: U1.17 37.95,14.16 v37.94,14.18
  Bottom 0.203: v37.94,14.18 37.94,13.07 36.88,12.01 36.88,10.46 36.02,9.6 36.02,9.5 35.92,9.5 35.78,9.36 34.32,9.36 30.66,5.7 30.66,4.95 26.98,1.27 JP2.10
AIN5_A3  (via drill 0.19)
  Top 0.203: v31.95,13.9 U1.23
  Bottom 0.203: JP2.7 19.05,1.56 20.98,3.49 20.99,3.49 21.38,3.88 26.33,3.88 26.91,4.45 27.39,4.45 28.7,5.75 28.7,5.78 30.18,7.26 30.5,7.26 30.79,7.56 30.79,7.96 31.79,8.95 32.19,8.95 32.67,9.44 32.67,10.42 32,11.09 32,13.85 v31.95,13.9
AIN6_A2  (via drill 0.19)
  Top 0.203: U1.24 30.95,13.6 v31.23,13.88
  Bottom 0.203: v31.23,13.88 31.59,13.51 31.59,11.42 30.94,10.77 30.94,9.28 29.77,8.11 29.77,7.43 27.25,4.91 25.64,4.91 25.04,4.31 21.22,4.31 19.61,2.7 18.95,2.7 17.52,1.27 JP2.6
AIN7_A4/SDA  (via drill 0.2)
  Top 0.203: U1.20 34.6,13.36 34.6,13.96 33.66,14.9 v33.63,14.9
  PWR 0.2: 4.39,14.48 4.38,14.47 4.38,13.97 4.4,13.95 v4.44,13.95 | v9.25,6.75 v9.25,6.74 9.91,6.07
  PWR 0.203: v33.63,14.9 32.85,14.9 32.39,15.36 26.55,15.36 26.52,15.34 26.33,15.34 25.69,15.99 25.11,15.99 24.47,15.34 24.27,15.34 18.95,15.34 18.18,15.34 17.93,15.09 17.29,15.09 16.95,15.44 5.35,15.44 4.39,14.48 | JP2.8 21.59,1.39 20.65,2.33 20.65,3.66 19.57,4.74 14.12,4.74 13.98,4.59 13.07,4.59 13.03,4.55 12.69,4.89 12.69,5.77 12.39,6.07 9.91,6.07
  MID 0.2: v4.44,13.95 4.44,13.14 8.82,8.76 8.82,7.17 v9.25,6.75
D2  (via drill 0.19)
  Top 0.203: U1.39 34.7,11.64 v34.7,11.09
  Bottom 0.203: v34.7,11.09 34.7,13.11 34.13,13.68 34.13,15.11 33.33,15.91 32.79,15.91 32.29,15.41 30.31,15.41 JP3.5
D3~
  Top 0.203: JP3.6 27.95,15.23 32.13,15.23 33.95,13.41 U1.21
D4  (via drill 0.19)
  Top 0.203: U1.40 33.15,11.09 33.15,10.79 v33.12,10.81
  Bottom 0.203: v33.12,10.81 33.12,14.11 32.24,15 26.66,15 25.16,16.51 JP3.7
D5~
  Top 0.203: U1.22 33.02,13.09 33.02,13.76 31.96,14.82 23.93,14.82 22.24,16.51 JP3.8
D6~  (via drill 0.19)
  Top 0.203: U1.41 32.49,11.58 32.49,11.28 32.54,11.34 v32.62,11.26
  Bottom 0.2: 21.07,14.59 21.13,14.53 21.19,14.53 21.8,13.92 27.05,13.92 27.72,14.59 28.07,14.59
  Bottom 0.203: v32.62,11.26 32.62,11.21 32.62,14.04 32.06,14.59 28.07,14.59 | JP3.9 19.15,16.51 21.07,14.59
D7  (via drill 0.2)
  Top 0.203: U1.47 28.6,13.09 28.6,13.81 v28.41,13.99
  Bottom 0.203: SJ2.2 JP3.10 17.53,16.51 19.42,14.62 19.67,14.62 20.77,13.52 27.21,13.52 27.77,14.07 28.34,14.07 v28.41,13.99
D8  (via drill 0.2)
  Top 0.203: U1.48 28.65,11.88 27.79,12.74 v27.79,12.97
  Bottom 0.203: JP3.11 SJ3.2 13.34,14.38 13.05,14.38 12.87,14.2 12.87,12.46 15.63,9.7 17.17,9.7 17.98,10.52 18.03,10.56 18.03,10.98 17.9,11.11 17.9,12.06 17.61,12.35 17.61,13.21 18.21,13.81 19.67,13.81 20.36,13.11 27.64,13.11 v27.79,12.97
D9~  (via drill 0.19)
  Top 0.203: U1.44 v31.98,9.44 v31.98,9.46
  MID 0.203: v31.98,9.46 31.86,9.46 30.23,11.09 28.98,11.09 28.22,11.84 27.63,11.84 25.5,13.97 21.76,13.97 21.1,14.63 13.31,14.63 JP3.12
D10~  (via drill 0.19)
  Top 0.203: U1.36 37.15,6.59 37,6.74 37,7.21 37,7.8 v36.98,7.82
  MID 0.203: v36.98,7.82 35.85,8.95 31.95,8.95 31.77,8.95 30.06,10.67 27.93,10.67 26.48,12.12 26.48,12.41 25.37,13.52 20.77,13.52 20.48,13.81 20.48,13.82 20.07,14.22 13.14,14.22 11.92,15.44 10.99,15.44 9.92,16.51 JP3.13
GND  (via drill 0.19, 0.2, 0.3)
  Top 0.2: C2.2 12.66,12.5 C3.2
  Top 0.203: U2.20 22.2,13.64 22.27,13.72 22.32,13.68 22.65,13.68 22.65,13.34 22.61,13.3 22.61,13.97 | 22.61,13.97 22.61,14.59 C7.1 | U2.19 22.62,13.96 22.61,13.97 | LPS-1.3 v22.44,3.35 v22.43,3.35 | LPS-1.9 23.25,5.47 v23.73,5.95 | v29.7,12.03 29.77,11.95 29.77,11.52 30.02,11.27 U1.26 | U1.GND@12 32.73,9.73 v33.2,10.2 33.31,10.31 33.33,10.31 33.63,10.61 33.63,10.63 33.64,10.64 U1.GND@10 | U3.GND 26.1,7.22 v26.1,6.33 | U3.GND 27.15,7.42 arc90 27.55,7.83 U3.GND@3 | U3.GND 24.88,7.42 arc-90 24.3,8 24.3,8.62 arc-90 U3.GND@4 24.25,9.57 24.55,9.88 24.8,9.88 arc-90 24.85,9.93 U3.GND@2 27.05,9.93 27.1,9.88 arc-90 27.55,9.43 U3.GND@3 | U3.GND@3 27.65,8.57 27.65,8.03 arc90 28.79,6.89 U1.53 | LPS-1.8 24.34,5.19 arc90 24.35,5.2 24.35,5.17 arc-90 24.7,4.83 v24.73,4.83 | IC1.13 17.57,7.65 | 17.57,7.65 17.62,7.65 17.76,7.52 17.76,6.98 17.52,6.75 17.5,6.75 | 17.57,7.65 17.57,8.38 17.7,8.38 v18,8.68 C15.2 | v17.4,11.85 17.4,11.55 HS-1.P$5.GND 17.23,11.38 17.65,11.38 18.53,10.5 v19.07,10.5 | R9.1 13.16,12.04 C3.2 | 17.5,6.75 IC1.12 | 18.79,5.46 C4.2 18.75,5.12 18.75,6.28 17.97,6.28 17.5,6.75 | v13.6,5.5 14.38,5.5 IC1.3
  PWR 0.406: v29.7,12.03 29.7,13.4 v30.3,14
  other vias: 35.65,2.12 37.52,6.95 38.55,5.8 5.17,7.53 2.6,2.1 5.2,4.1 12.03,5.5 11.97,8.4 25.9,2.3 9,11.4 37.7,9.3 39.85,14.95 8.9,13.97 34.95,5.1 23.8,3.27 30.5,16.12 37.35,8.45 36.67,3.27 40.48,2.08 24.23,9.15 23.93,10.28 20.32,16.38 14.18,12.22
  pour Bottom: 0,18 43.18,18 43.18,13.9 39.75,13.9 39.75,3.8 43.18,3.8 43.18,0 0,0
  pour Top (rank 6): 0,18 43.15,18 43.17,18.02 43.17,13.88 39.83,13.88 39.75,3.8 43.18,3.8 43.18,0 0,0
  pour MID: 0.05,18 43.18,18 43.18,13.9 39.75,13.9 39.77,0 0,0 0,17.8
INT_APDS  (via drill 0.19, 0.2)
  Top 0.203: U1.52 28.68,7.76 v28.23,7.76 v28.23,7.77 | v22.27,7.39 22.26,7.41 U5.2
  PWR 0.203: v28.23,7.77 28.22,7.75 26.55,7.75 26.5,7.8 24,7.8 23.59,7.39 v22.27,7.39
LB  (via drill 0.2)
  Top 0.203: U1.43 31.43,10.54 v31.46,10.57 | R12.1 27.35,14.2 27.79,13.76 v28,13.55
  PWR 0.203: v31.46,10.57 29.9,10.57 29.08,11.39 29.08,12.47 v28,13.55
LG  (via drill 0.2)
  Top 0.203: R11.1 26.25,10.8 v25.32,10.8
  Top 0.254: v33.08,5.42 33.08,5.33 32.95,5.2 U1.4
  MID 0.203: v33.08,5.42 33.08,5.55 31.8,6.83 28.51,6.83 28.48,6.86 28.23,7.11 27.25,7.11 26.21,8.15 26.21,9.92 v25.32,10.8
LR  (via drill 0.2)
  Top 0.203: U1.5 v33.95,5.37 | R7.1 25.07,11.93 v25.05,11.93
  MID 0.203: v33.95,5.37 33.9,5.32 31.99,7.23 29.48,7.23 28.42,8.29 27.81,8.29 27.26,8.84 27.26,9.6 25.05,11.81 v25.05,11.93
MIC_PWR  (via drill 0.2)
  Top 0.2: U1.51 28.51,8.89 v28.17,9.23
  Top 0.203: U3.1 U3.2 26.75,8.25 v26.94,8.43
  PWR 0.203: v26.94,8.43 26.94,8.49 27.68,9.23 v28.17,9.23
MISO~  (via drill 0.19)
  Top 0.203: U1.34 34.65,6.34 v34.65,6.65
  MID 0.2: JP3.15 4.84,16.51 6.32,15.04
  MID 0.203: v34.65,6.65 34.59,6.71 34.59,7.84 34.29,8.14 31.44,8.14 31.29,8.28 29.03,8.28 28.61,8.7 27.98,8.7 27.66,9.01 27.66,9.79 25.65,11.8 25.65,12.09 25.04,12.71 19.33,12.71 18.62,13.41 12.8,13.41 11.59,14.63 10.65,14.63 10.24,15.04 6.32,15.04
MOSI  (via drill 0.19)
  Top 0.203: U1.35 35.15,7 35.15,7.2 v35.1,7.2 v35.09,7.19
  MID 0.203: v35.09,7.19 35.09,7.91 34.46,8.54 31.61,8.54 30.86,9.3 29.86,9.3 28.9,10.26 27.76,10.26 26.07,11.95 26.07,12.25 25.2,13.11 20.44,13.11 19.73,13.82 12.97,13.82 11.75,15.04 10.82,15.04 10.41,15.44 7.42,15.44 JP3.14
N$1
  Top 0.61: C1.1 6.48,7.04 D1.1 | C1.1 5.23,5.79 J1.6 4.18,5.02 4.2,5 4.09,4.89 J1.7 J1.8 J1.9 J1.10 4.11,12.89 4.2,12.8 4.18,12.78 J1.11 | C1.1 5.87,5.42 R1.2
N$2  (via drill 0.25, 0.3)
  Top 0.254: v3.85,14.68 4.92,14.68 R2.1 | v1.79,15.29 1.69,15.29 DL2.A
  Bottom 0.254: v3.85,14.68 3.8,14.68 3.19,15.29 v1.79,15.29
N$3  (via drill 0.2, 0.3)
  Top 0.254: v1.6,3.1 DL1.A | R3.1 v3.66,3.09
  Bottom 0.254: v3.66,3.09 1.61,3.09 v1.6,3.1
N$4
  Top 0.203: C5.2 20.48,14.5 U2.24
N$5
  Top 0.254: R8.2 12.35,4.69 R6.1 13.02,4.86 13.02,6.12 13.65,6.75 IC1.1
N$6  (via drill 0.2)
  Top 0.254: IC1.18 14.43,8 13.71,8 v13.62,8.09 | R9.2 13.72,10.32 v13.72,9.9
  PWR 0.203: v13.62,8.09 12.8,8.09 12.53,8.35 12.53,8.91 13.53,9.9 v13.72,9.9
N$7  (via drill 0.2)
  Top 0.254: IC1.17 14.96,7.68 14.96,8.19 14.52,8.63 13.07,8.63 v13.04,8.66 | R10.1 14.8,10.16 v14.57,9.94
  PWR 0.254: v13.04,8.66 13.93,8.66 14.57,9.31 v14.57,9.94
N$8
  Top 0.203: U2.21 21.77,14.61 C7.2
N$9
  Top 0.203: U5.4 U5.3
N$10  (via drill 0.2, 0.3)
  Top 0.203: v7.03,13.88 7.03,14.2 6.53,14.7 R2.2 | U1.33 33.7,6.26 33.43,6.54 33.4,6.54 33.23,6.71 33.23,6.74 v33.12,6.84
  PWR 0.203: v27.35,6.35 27.38,6.32 32.61,6.32 v33.12,6.84
  MID 0.203: v7.03,13.88 7.4,13.88 10.07,11.21 13.23,11.21 13.56,10.88 15.17,10.88 15.59,11.31 17.19,11.31 17.21,11.33 17.68,11.33 18.37,10.65 18.52,10.65 18.87,11.01 24.38,11.01 25.78,9.6 25.78,8 27.35,6.42 v27.35,6.35
N$11
  Top 0.203: R12.2 26.25,13.62 26.42,13.46 26.58,13.46 26.75,13.28 26.75,13.24 DL3.3
N$12
  Top 0.203: R7.2 25.6,13.55 DL3.2
N$13
  Top 0.203: DL3.4 27.25,11.9 R11.2
N$14
  Bottom 0.305: JP2.12 31.75,3.42 SJ1.2
N$15  (via drill 0.2)
  Top 0.203: v23.15,9.1 23.23,9.19 U5.8 | C16.1 16.24,9.53 18.03,9.53 R15.1 18.02,9.46 v18.15,9.33
  Bottom 0.203: v18.15,9.33 19.07,8.41 22.29,8.41 22.98,9.1 v23.15,9.1
N$16  (via drill 0.2, 0.3)
  Top 0.203: v18.39,4.15 v18.4,4.14 v18.4,3.6
  Top 0.254: v13.5,3.35 13.19,3.66 R6.2 | IC1.8 IC1.20
  Bottom 0.203: SJ4.2 18.02,4.2 18.02,4.15 | 18.02,4.15 v18.39,4.15 18.39,4.17 18.32,4.17 | v13.5,3.35 14.05,2.79 17.3,2.79 18.02,3.52 18.02,4.15
  pour Top (rank 5, no thermals): 16.6,3.02 19.07,3.02 19.11,3.06 19.11,4.49 18.09,4.49 17.69,4.89 16.55,4.89 16.55,4.49 16.54,4.47 16.54,3.08 16.57,3.04
N$17
  Bottom 0.61: 16.75,4.17 17.62,4.17
NFC1  (via drill 0.19, 0.2)
  Top 0.203: U1.28 30,8.88 29.88,8.88 v29.73,8.79
  MID 0.203: v30.32,12.03 30.32,12.15 30.25,12.22 30.25,13.28 29.02,14.5 26.12,14.5 25.83,14.78 22.1,14.78 21.44,15.44 17.88,15.44 v17.73,15.6
  Bottom 0.203: v30.32,12.03 30.52,11.82 30.52,9.59 v29.73,8.79 | v17.73,15.6 17.62,15.5 17.62,13.8 17.25,13.43 16.56,13.43 SJ2.1
NFC2  (via drill 0.19, 0.2, 0.3)
  Top 0.203: U1.29 30.12,7.88 v30.28,7.77
  MID 0.2: 16.9,15.04 16.41,15.04 15.28,16.18
  MID 0.203: v32.17,10.21 32.17,10.59 31.74,11.02 31.73,11.02 31.67,11.08 30.86,11.08 30.43,11.51 29.46,11.51 28.51,12.46 27.58,12.46 25.66,14.38 21.93,14.38 21.27,15.04 16.9,15.04 | 15.28,16.18 v15.3,16.18
  Bottom 0.203: v32.17,10.21 32.17,10.06 32.07,9.96 31.77,9.96 31.48,9.66 31.48,9.22 30.28,8.02 v30.28,7.77 | SJ3.1 13.98,13.5 14.28,13.5 15.3,14.52 v15.3,16.18
PDMCLK  (via drill 0.2)
  Top 0.203: U1.42 31.02,12.02 v31.04,12.04 | v26.73,9.32 26.73,9.25 U3.3
  Bottom 0.203: v31.04,12.04 30.52,12.55 29.49,12.55 29.18,12.24 29.18,10.93 28.9,10.65 28,10.65 26.73,9.38 v26.73,9.32
PDMDIN  (via drill 0.2)
  Top 0.203: v35.95,4.17 U1.7 | U3.4 25,9.1 v24.82,9.28
  MID 0.2: v35.95,4.17 34.54,4.17 34.14,4.58 34.05,4.58 | 32.25,4.58 31,5.83 27.08,5.83 26.64,6.27
  MID 0.203: v24.82,9.28 25.12,8.97 25.12,8.05 26.64,6.54 26.64,6.27 | 34.05,4.58 32.25,4.58
R_PULLUP  (via drill 0.2, 0.3)
  Top 0.203: R14.2 20.23,4.08 v19.48,4.08 | v37.05,4.2 36.95,4.3 U1.8
  Top 0.254: R13.2 20.42,4.26 R14.2
  PWR 0.203: v27.99,1.49 28.14,1.64 28.14,1.71 28.77,2.34 32.48,2.34 32.6,2.22 33.73,2.22 33.85,2.34 35.02,2.34 36.47,3.78 36.63,3.78 v37.05,4.2
  MID 0.2: 24.93,4.32 25.45,3.8 25.8,3.8 25.9,3.8 25.97,3.8 26.62,4.45 27.45,4.45 28.23,3.67 28.23,3.58
  MID 0.203: v19.48,4.08 19.72,4.32 24.93,4.32 | 28.23,3.58 28.23,1.9 27.9,1.57 v27.99,1.49
RESETN  (via drill 0.2, 0.3)
  Top 0.2: v11.07,10.25 11.07,11.22 PB1.5 10.82,11.53 C2.1
  Top 0.254: R5.1 C2.1 | U1.19 35.95,14.85 JP3.3
  MID 0.2: 13.41,9.48 13.43,9.48 13.52,9.39 15.45,9.39 16.12,8.73 16.12,8.7 16.9,7.92 | 34.41,3.74 34.41,3.73 34.42,3.72 34.42,1.71 34.29,1.57 JP2.13 | 26.99,5.39 30.86,5.39 32.08,4.17 | 26.02,5.39 25.57,5.83 25.57,6.18 24.77,6.98 24.34,6.98 24.05,6.69 18.82,6.69
  MID 0.203: 13.41,9.48 12.64,10.25 v11.07,10.25 | 38.62,11.76 38.62,6.64 38.05,6.07 38.05,5.59 38.05,3.6 37.17,2.73 35.42,2.73 34.41,3.74 34,4.15 32.15,4.15 32.13,4.17 32.08,4.17 | JP3.3 35.95,14.85 35.95,14.38 38.17,12.15 38.2,12.15 38.59,11.76 38.62,11.76 | 16.9,7.92 17.59,7.92 18.82,6.69 | 38.62,11.76 40.96,11.76 v40.98,11.78 | 26.99,5.39 26.02,5.39
  Bottom 0.203: v40.98,11.78 41.32,11.43 J3.6
RX  (via drill 0.19)
  Top 0.203: v35.41,10.3 35.52,10.41 35.52,11.12 35.7,11.29 35.72,11.29 36,11.57 U1.38
  Bottom 0.203: JP3.2 36.83,16.48 35.99,15.64 35.99,10.88 v35.41,10.3
SCK  (via drill 0.19)
  Top 0.203: U1.1 29.95,4.53 29.42,4 27.16,4 v27.11,3.95 | R3.2 5.25,2.71 JP2.1
  MID 0.2: 24.52,3.88 24.7,3.88 25.23,3.35 26.24,3.35 26.86,3.98 26.9,3.98
  MID 0.203: v27.11,3.95 27.09,3.98 26.9,3.98 | 24.52,3.88 21.36,3.88 20.28,2.79 5.33,2.79 JP2.1
SCL1  (via drill 0.2, 0.3)
  Top 0.203: U4.6 v10.93,3.69 v10.93,3.7 | U2.2 20.05,12.79 18.28,12.79 v18.18,12.9 | v16.48,10.8 16.23,10.8 15.7,10.28 HS-1.P$2.SCL/SPC | LPS-1.2 22.21,4.17 22.01,3.98 22.01,3.83 21.83,3.65 21.68,3.65 R13.1 | v22.51,2.14 22.28,2.36 21.71,2.36 v21.16,2.91 | U1.3 31.95,4.33 30.57,2.95 27.53,2.95 v27.05,2.47
  Top 0.254: R13.1 21.16,3.13 v21.16,2.91 | U5.7 22.05,9.44 v22.05,9.05
  PWR 0.2: 21.02,13.5 21.05,13.52 21.19,13.52 22.2,14.53 27.65,14.53 27.95,14.82
  PWR 0.203: v10.93,3.7 10.93,2.59 v10.01,1.68 | 27.95,14.82 28.06,14.93 32.23,14.93 32.78,14.38 35.11,14.38 35.32,14.59 36.54,14.59 v36.68,14.45 | v17.52,10.78 17.52,10.92 | 17.52,10.92 17.41,11.03 16.76,11.03 16.52,10.8 v16.48,10.8 | 21.02,13.5 20.37,13.5 19.65,12.78 18.29,12.78 v18.18,12.9 17.92,12.65 17.92,11.32 17.52,10.92
  MID 0.203: 10.28,1.68 10.33,1.68 11.01,2.36 20.61,2.36 v21.16,2.91 | v22.05,9.05 21.12,9.98 18.32,9.98 v17.52,10.78
  MID 0.254: v10.01,1.68 10.28,1.68
  Bottom 0.203: v36.68,14.45 36.68,12.39 36.47,12.18 36.47,10.65 35.61,9.79 34.17,9.79 32.52,8.14 32.12,8.14 31.61,7.62 31.61,7.22 30.68,6.3 30.67,6.3 28.15,3.78 28.15,3.63 27.05,2.53 v27.05,2.47 26.6,2.47 26.19,2.88 25.66,2.88 25.13,2.34 22.71,2.34 v22.51,2.14
SDA1  (via drill 0.19, 0.2, 0.3)
  Top 0.203: 10.34,3.12 10.4,3.05 | U2.4 19.34,11.91 19.12,11.7 18.82,11.7 v18.43,11.31 | HS-1.P$4.SDA/SDI/SDO 17.12,10.45 v16.98,10.45 | LPS-1.4 23.2,3.61 23.2,3.08 v23.18,3.07 | U5.1 23.23,8.35 v23.1,8.48 | 20.41,2.6 20.36,2.55 v20.36,1.78 | U1.2 30.95,4.08 30.23,3.36 27.03,3.36 v26.84,3.17
  Top 0.254: R14.1 20.41,2.6 20.41,2.46 20.37,2.49 10.96,2.49 10.4,3.05 | U4.5 10.34,3.12
  PWR 0.2: 21.35,13.09 22.38,14.12 27.83,14.12 28.21,14.51 28.52,14.51 | 19.58,12.14 19.69,12.03 19.69,10.88 20.65,9.92 22.28,9.92 22.62,9.58 22.62,8.91 23.07,8.45
  PWR 0.203: v16.98,10.45 17.27,10.15 18.05,10.15 18.45,10.55 18.45,11.29 v18.43,11.31 18.43,11.29 18.73,11.29 19.58,12.14 20.54,13.09 21.35,13.09 | 23.07,8.45 v23.1,8.48 | v35.41,13.97 32.58,13.97 32.05,14.51 28.52,14.51
  Bottom 0.203: v35.41,13.97 35.58,13.81 35.58,11.04 35.34,10.8 35.12,10.8 34.91,10.59 34.4,10.59 32.36,8.55 31.96,8.55 31.2,7.79 31.2,7.39 30.67,6.86 30.38,6.86 27.71,4.19 27.71,3.82 27.34,3.45 26.85,3.45 | 26.85,3.45 25.62,3.45 24.93,2.75 23.39,2.75 23.18,2.96 v23.18,3.07 22.87,2.75 22.33,2.75 21.92,2.34 21.15,2.34 20.71,1.9 20.35,1.9 20.36,1.9 v20.36,1.78 | v26.84,3.17 v26.85,3.17 26.85,3.45
SWCLK  (via drill 0.2, 0.3)
  Top 0.254: U1.11 38.38,6.89 v38.09,7.19 | R4.1 40.9,3.07 v40.9,2.8
  Bottom 0.203: J3.3 39.27,8.37 v38.09,7.19 38.09,6.05 38.05,6.01 38.05,5.59 38.34,5.3 38.4,5.3 v40.9,2.8
SWDIO  (via drill 0.3)
  Top 0.203: U1.15 39.51,10.89 39.77,10.62 v39.77,10.6
  MID 0.203: v39.77,10.6 39.77,7.3 v40.05,7.03
  Bottom 0.203: v40.05,7.03 40.16,7.03 40.83,6.35 J3.2
TX  (via drill 0.3)
  Top 0.203: U1.37 37.87,11.64 v37.96,11.55
  Bottom 0.203: v37.96,11.55 38.08,11.67 38.08,11.95 39.25,13.11 39.25,15.23 39.37,15.35 JP3.1
USB_N  (via drill 0.19)
  Top 0.203: 8.14,9.49 4.36,9.49 J1.2 | 8.14,9.49 8.2,9.55 8.2,10.43 D1.3 | 8.14,9.49 10.24,9.49 v10.3,9.55 | U1.55 28.62,4.89 28.15,5.37 25.68,5.37 arc-90 v25.07,5.97
  Bottom 0.203: D-.X 3.52,12.6 3.52,8.6 3.65,8.47 9.1,8.47 10.18,9.55 v10.3,9.55 10.62,9.55 arc-90 11.28,8.9 11.28,8.88 arc90 13.7,6.45 22.7,6.45 arc-90 23.27,7.03 24.6,7.03 arc-90 25.07,6.55 v25.07,5.97
USB_P  (via drill 0.19)
  Top 0.203: 8.06,8.96 4.38,8.96 J1.3 | 8.06,8.96 8.15,8.88 8.15,8.18 D1.2 | 8.06,8.96 10.21,8.96 v10.28,8.9 | U1.54 28.39,5.89 arc90 28.27,5.78 25.93,5.78 arc-90 25.6,6.1 arc90 25.15,6.55 24.62,6.55 arc90 v24.55,6.48
  Bottom 0.203: D+.X 3.1,10.49 3.1,8.45 3.5,8.05 9.53,8.05 10.32,8.85 v10.28,8.9 10.45,8.9 arc-90 10.88,8.47 arc90 13.32,6.03 22.88,6.03 arc90 23.12,6.28 arc-90 23.33,6.48 v24.55,6.48
VBUS  (via drill 0.19)
  Top 0.406: v31.77,5.76 U1.31 | v33.92,3.51 33.8,3.39 33.8,3.3 L1.2 33.99,3.31 C10.2
  PWR 0.406: v31.77,5.76 31.77,5.64 33.9,3.51 v33.92,3.51
  Bottom 0.305: SJ1.1 v31.76,5.75 v31.77,5.76
VDD_ENV  (via drill 0.2)
  Top 0.203: U2.23 20.91,13.97 v20.97,14.04 v20.98,14.03 21.34,14.03 U2.22 | U2.1 20,13.3 v19.45,13.3 19.23,13.3 18.85,13.68 C11.2 | U1.49 28.45,10.89 v28.06,11.29 | 20.05,10.38 19.6,10.38 19.6,11.45 20.05,11.45 U2.5 | U2.6 20.05,10.38 | 20.05,10.38 20.48,10.38 | 20.48,10.38 20.71,10.38 v20.82,10.48 20.89,10.56 20.89,10.9 U2.8 | U2.7 20.48,10.38 | U2.3 20.07,12.34 19.71,12.34 19.69,12.32 19.17,12.32 19.12,12.27 v18.95,12.27 18.12,12.27 18.01,12.38 16.6,12.38 C12.2 16.43,12.2 16.43,11.53 HS-1.P$6.CS 15.88,11.53 HS-1.P$1.VDD | v21.2,7.47 21.45,7.22 C14.2 C13.2 21.85,4.88 | v24.5,3.29 24.55,3.33 24.55,4.08 24.45,4.17 LPS-1.6 24.02,4.2 23.26,4.2 22.78,4.68 22.49,4.68 LPS-1.1 22.05,4.67 21.85,4.88 | LPS-1.10 22.16,5.19 21.85,4.88
  PWR 0.203: v28.06,11.29 27.07,10.29 25.09,10.29 24.53,10.85 21.25,10.85 20.82,10.43 v20.82,10.48 | v20.98,14.03 20.18,14.03 v19.45,13.3
  MID 0.203: v20.82,10.48 21.33,10.48 22.61,9.21 22.61,8.86 21.22,7.47 v21.2,7.47
  Bottom 0.203: v19.45,13.3 19.35,13.3 18.93,12.88 18.93,12.29 v18.95,12.27 20.73,10.48 v20.82,10.48
VIN  (via drill 0.2, 0.3)
  Top 0.203: 15.55,8.3 15.55,8.55 v15.56,8.5
  Top 0.254: IC1.16 15.43,8.18 15.55,8.3
  Top 0.406: v14.86,11.41 R10.2 | v19.55,7.36 19.27,7.09 C4.1
  Top 0.61: D2.C 9.71,13.15 9.71,13.77 v9.68,13.8
  PWR 0.61: JP2.15 39.76,1.67 39.76,2.94 38.59,4.11 38.59,4.69 35.31,7.96 33.2,7.96 32.3,7.06 26.55,7.06 26.47,7.14 26.3,7.14 26.25,7.19 24.25,7.19 23.73,6.66 20.93,6.66 20.23,7.36 v19.55,7.36 16.69,7.36 15.56,8.49 v15.56,8.5 15.36,8.7 15.36,10.16 14.86,10.66 v14.86,11.41 11.44,11.41 9.68,13.18 v9.68,13.8
VUSB  (via drill 0.19, 0.2)
  Top 0.406: J1.1 4.57,10.45 D1.4 v6.28,13.42 v6.28,13.43 | v32.96,2.73 32.86,2.73 32.38,3.21 L1.1 | v25.85,4.38 25.73,4.26 C6.2
  Top 0.61: D2.A 6.29,10.46 D1.4
  PWR 0.406: v32.96,2.73 32.84,2.85 29.09,2.85 27.29,4.65 25.85,4.65 v25.85,4.38 25.59,4.12 21.52,4.12 19.98,5.67 14.28,5.67 12.9,7.05 10.66,7.05 6.28,11.44 v6.28,13.43

### Text on the board
test-probe: 5V | VIN(5V) | VCC | GND | RESET | 14 | 13 | 12 | 11 | 10 | 9 | 8 | 7 | 6 | USB_5V | USB_D- | SWCLK | SWDIO | JGND | JRST | VTG | BATT+ | BATT- | USB_D+ | USB_GND | AREF | A0 | A1 | A2 | A3 | A4 | A5 | A6 | 0 | 1 | 2 | 3 | 4 | 5